# EAGLE schematic fonte (EAGLE 5.06)
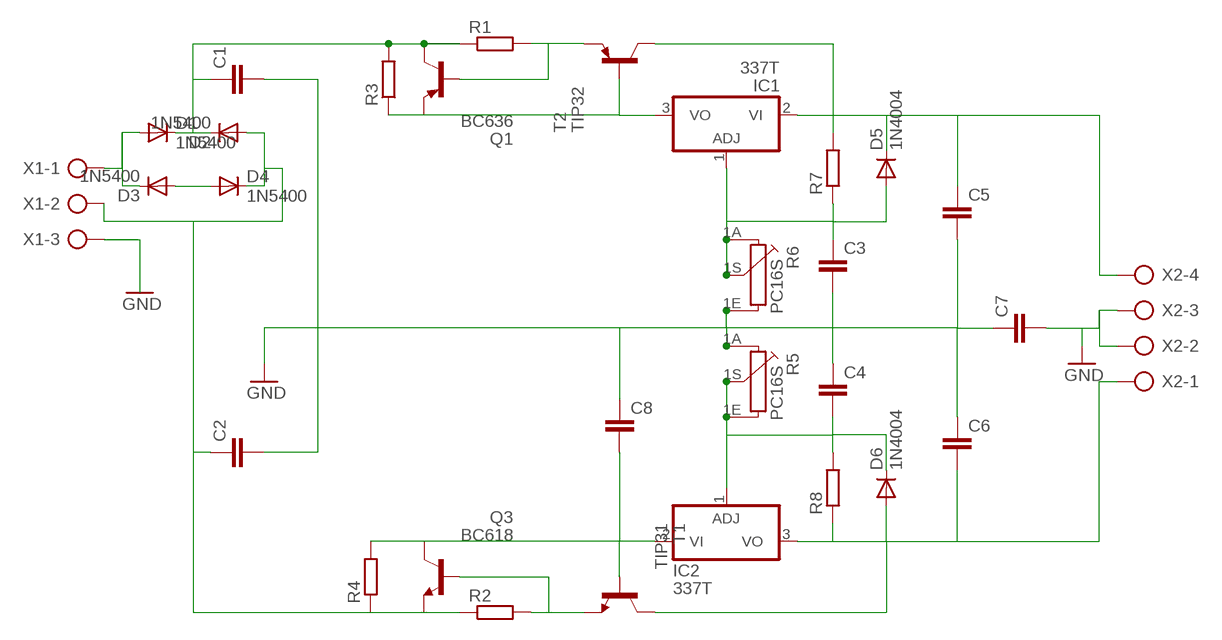
[diagram p0: schematic, sheet 1]

## Parts
C1  C-EU150-072X183  [C150-072X183]
C2  C-EU150-072X183  [C150-072X183]
C3  C-EU050-050X075  [C050-050X075]
C4  C-EU050-050X075  [C050-050X075]
C5  C-EU050-050X075  [C050-050X075]
C6  C-EU050-050X075  [C050-050X075]
C7  C-EU025-024X044  [C025-024X044]
C8  C-EU050-050X075  [C050-050X075]
D1  1N5400  [DO201-15]
D2  1N5400  [DO201-15]
D3  1N5400  [DO201-15]
D4  1N5400  [DO201-15]
D5  1N4004  [DO41-10]
D6  1N4004  [DO41-10]
IC1  337T  [TO220H]
IC2  337T  [TO220H]
Q1  BC636  [TO92-BCE]
Q3  BC618  [TO92-EBC]
R1  R-EU_0411/15  [0411/15]
R2  R-EU_0411/15  [0411/15]
R3  R-EU_0411/15  [0411/15]
R4  R-EU_0411/15  [0411/15]
R5  PC16S  [PC16S]
R6  PC16S  [PC16S]
R7  R-EU_0207/12  [0207/12]
R8  R-EU_0207/12  [0207/12]
T1  TIP31  [TO220]
T2  TIP32  [TO220]
X1  AK300/3  [AK300/3]
X2  AK300/4  [AK300/4]

## Nets
GND: C1.2 C2.2 C3.2 C4.1 C5.2 C6.1 C7.1 C7.2 C8.1 R5.1A R6.1E X2.2 X2.3
N$1: D1.A D3.C X1.1
N$2: D3.A D4.A
N$3: C1.1 D1.C D2.C Q1.C R1.1 R3.2
N$4: C2.1 D2.A D4.C R2.1 R4.1 X1.2
N$5: IC1.3(VO) R3.1 T2.1(B)
N$6: C5.1 D5.C IC1.2(VI) R7.2 T2.2(C) X2.4
N$7: C3.1 D5.A IC1.1(ADJ) R6.1A R6.1S R7.1
N$8: C8.2 IC2.2(VI) Q3.C R4.2 T1.1(B)
N$9: X1.3
N$10: C6.2 D6.A IC2.3(VO) R8.1 T1.2(C) X2.1
N$11: C4.2 D6.C IC2.1(ADJ) R5.1E R5.1S R8.2
N$12: Q1.B R1.2 T2.3(E)
N$13: Q3.B R2.2 T1.3(E)
Unconnected: Q1.E Q3.E

## Library data of the parts
C1-C8 = rcl:C-EU: CAPACITOR, European symbol
D1-D4 = diode:1N5400: DIODE standard rectifier, 3 A, 50 V (Motorola)
D5 D6 = diode:1N4004: DIODE general purpose rectifier, 1 A
IC1 IC2 = linear:*337: Negative VOLTAGE REGULATOR
Q1 = transistor-pnp:BC636*: PNP Transistror
Q3 = transistor-npn:BC618*: NPN Transistor
R1-R4 R7 R8 = resistor:R-EU_: RESISTOR, European symbol
R5 R6 = piher:PC16S: POTENTIOMETER single carbon potentiometer, 16 mm, S3ROH
T1 = transistor:TIP31: NPN Transistor Medium Power Linear Switching Applications Source: http://onsemi.com
T2 = transistor:TIP32: PNP Transistor Medium Power Linear Switching Applications Source: http://onsemi.com
X1 = con-ptr500:AK300/3: CONNECTOR
X2 = con-ptr500:AK300/4: CONNECTOR